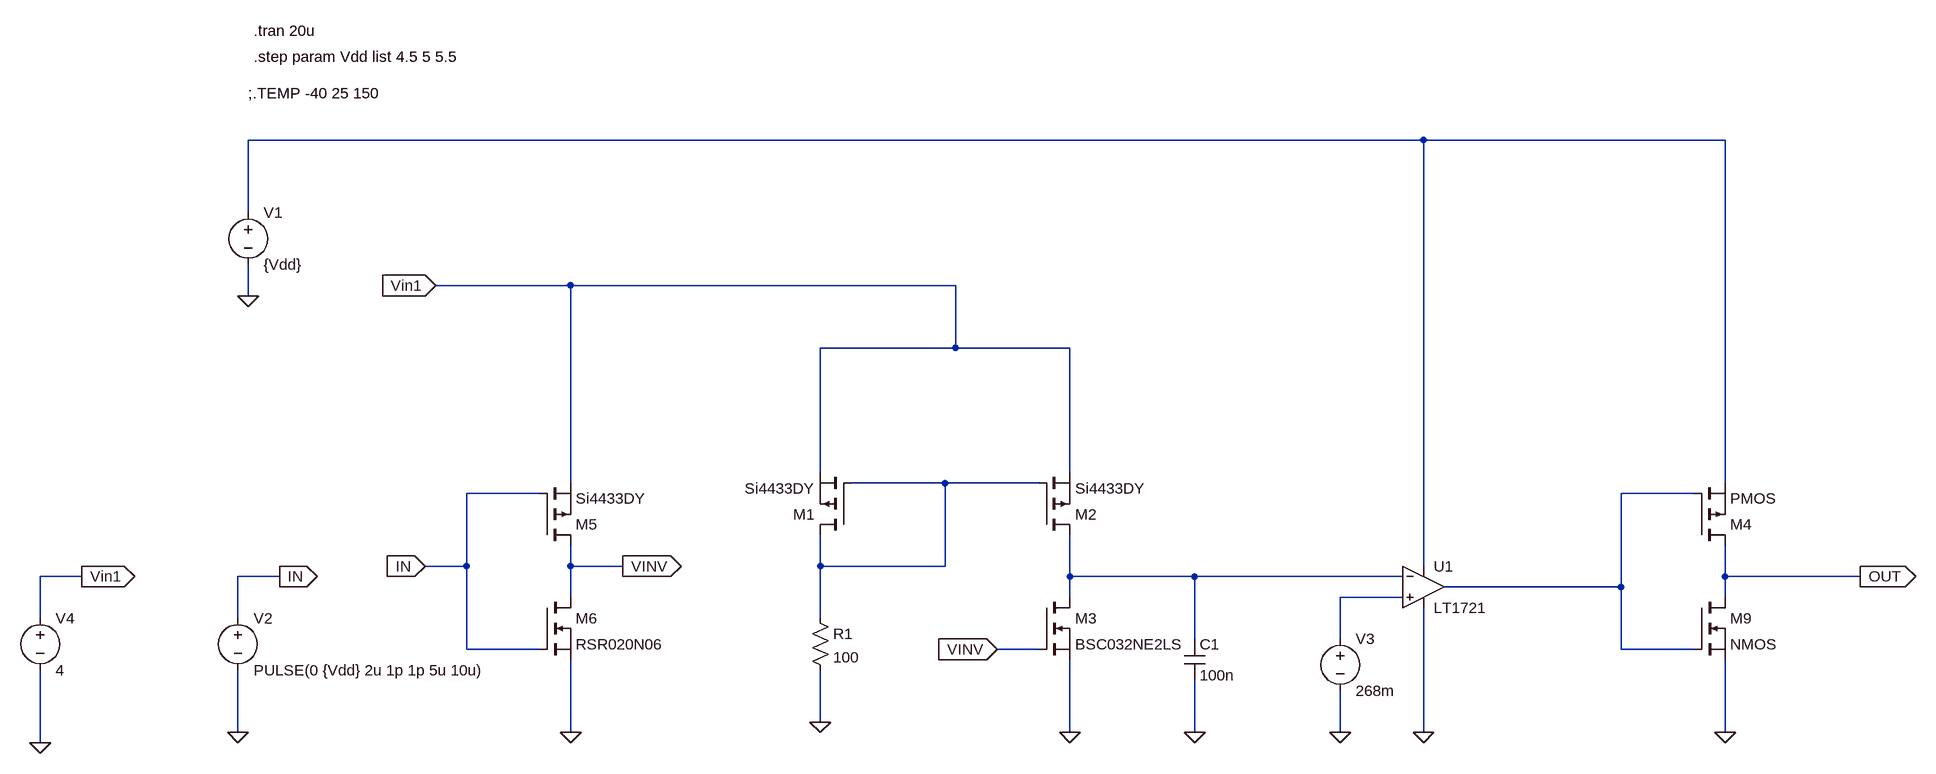
[diagram p0: schematic Report5_new.asc]
Report5_new.asc, the LTspice schematic file:
Version 4
SHEET 1 5052 1796
WIRE 1072 -384 -736 -384
WIRE 1536 -384 1072 -384
WIRE -736 -272 -736 -384
WIRE -240 -160 -448 -160
WIRE 352 -160 -240 -160
WIRE -736 -144 -736 -192
WIRE 352 -64 352 -160
WIRE 352 -64 144 -64
WIRE 528 -64 352 -64
WIRE 144 128 144 -64
WIRE 528 128 528 -64
WIRE -240 144 -240 -160
WIRE 336 144 192 144
WIRE 480 144 336 144
WIRE 1536 144 1536 -384
WIRE -288 160 -400 160
WIRE 1488 160 1376 160
WIRE -400 272 -400 160
WIRE -400 272 -464 272
WIRE -240 272 -240 240
WIRE -160 272 -240 272
WIRE 144 272 144 224
WIRE 336 272 336 144
WIRE 336 272 144 272
WIRE 1072 272 1072 -384
WIRE -992 288 -1056 288
WIRE -688 288 -752 288
WIRE 528 288 528 224
WIRE 720 288 528 288
WIRE 1040 288 720 288
WIRE 1536 288 1536 240
WIRE 1744 288 1536 288
WIRE 1376 304 1376 160
WIRE 1376 304 1104 304
WIRE -240 320 -240 272
WIRE 528 320 528 288
WIRE 1040 320 944 320
WIRE 1536 320 1536 288
WIRE -1056 352 -1056 288
WIRE -752 352 -752 288
WIRE 144 352 144 272
WIRE 720 384 720 288
WIRE 944 384 944 320
WIRE -400 400 -400 272
WIRE -288 400 -400 400
WIRE 480 400 416 400
WIRE 1376 400 1376 304
WIRE 1488 400 1376 400
WIRE 144 512 144 432
WIRE -752 528 -752 432
WIRE -240 528 -240 416
WIRE 528 528 528 416
WIRE 720 528 720 448
WIRE 944 528 944 464
WIRE 1072 528 1072 336
WIRE 1536 528 1536 416
WIRE -1056 544 -1056 432
FLAG 144 512 0
FLAG -736 -144 0
FLAG 720 528 0
FLAG 528 528 0
FLAG -752 528 0
FLAG 416 400 VINV
IOPIN 416 400 In
FLAG -240 528 0
FLAG 944 528 0
FLAG 1072 528 0
FLAG 1536 528 0
FLAG 1744 288 OUT
IOPIN 1744 288 Out
FLAG -160 272 VINV
IOPIN -160 272 Out
FLAG -448 -160 Vin1
IOPIN -448 -160 In
FLAG -992 288 Vin1
IOPIN -992 288 Out
FLAG -1056 544 0
FLAG -464 272 IN
IOPIN -464 272 In
FLAG -688 288 IN
IOPIN -688 288 Out
SYMBOL pmos 192 224 R180
SYMATTR InstName M1
SYMATTR Value Si4433DY
SYMBOL pmos 480 224 M180
SYMATTR InstName M2
SYMATTR Value Si4433DY
SYMBOL voltage -736 -288 R0
WINDOW 123 0 0 Left 0
WINDOW 39 0 0 Left 0
SYMATTR InstName V1
SYMATTR Value {Vdd}
SYMBOL cap 704 384 R0
SYMATTR InstName C1
SYMATTR Value 100n
SYMBOL res 128 336 R0
SYMATTR InstName R1
SYMATTR Value 100
SYMBOL voltage -752 336 R0
WINDOW 123 0 0 Left 0
WINDOW 39 0 0 Left 0
SYMATTR InstName V2
SYMATTR Value PULSE(0 {Vdd} 2u 1p 1p 5u 10u)
SYMBOL pmos -288 240 M180
SYMATTR InstName M5
SYMATTR Value Si4433DY
SYMBOL nmos -288 320 R0
SYMATTR InstName M6
SYMATTR Value RSR020N06
SYMBOL Comparators\\LT1721 1072 240 R0
SYMATTR InstName U1
SYMBOL voltage 944 368 R0
WINDOW 123 0 0 Left 0
WINDOW 39 0 0 Left 0
SYMATTR InstName V3
SYMATTR Value 268m
SYMBOL voltage -1056 336 R0
WINDOW 123 0 0 Left 0
WINDOW 39 0 0 Left 0
SYMATTR InstName V4
SYMATTR Value 4
SYMBOL nmos 480 320 R0
SYMATTR InstName M3
SYMATTR Value BSC032NE2LS
SYMBOL pmos 1488 240 M180
SYMATTR InstName M4
SYMBOL nmos 1488 320 R0
SYMATTR InstName M9
TEXT -736 -456 Left 2 !;.TEMP -40 25 150
TEXT -728 -552 Left 2 !.tran 20u
TEXT -728 -512 Left 2 !.step param Vdd list 4.5 5 5.5

The netlist it stands for:
* Report5_new.asc
M1 N002 N002 Vin1 Vin1 Si4433DY
M2 N004 N002 Vin1 Vin1 Si4433DY
V1 N001 0 {Vdd}
C1 N004 0 100n
R1 N002 0 100
V2 IN 0 PULSE(0 {Vdd} 2u 1p 1p 5u 10u)
M5 VINV IN Vin1 Vin1 Si4433DY
M6 VINV IN 0 0 RSR020N06
XU1 N005 N004 N001 0 N003 LT1720  ; LT1721, pins In+ In- V+ V- OUT
V3 N005 0 268m
V4 Vin1 0 4
M3 N004 VINV 0 0 BSC032NE2LS
M4 OUT N003 N001 N001 PMOS
M9 OUT N003 0 0 NMOS
.model NMOS NMOS
.model PMOS PMOS
.lib standard.mos
;.TEMP -40 25 150
.tran 20u
.step param Vdd list 4.5 5 5.5
.lib LTC.lib
.backanno
.end